# EAGLE design Gear Shifters (EAGLE 9.6.2)
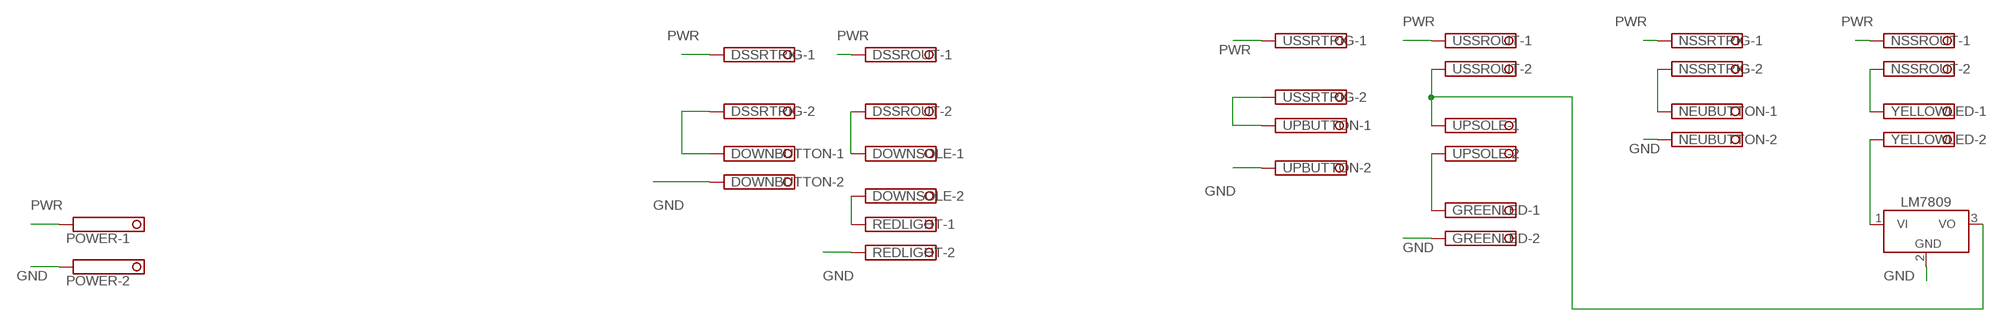
[diagram p0: schematic, sheet 1]

## Parts
DOWNBUTTON  TERMINAL-BLOCK-3.5MM-2-PIN-ROUND-PAD  [TERMINAL-BLOCK-2-PIN-3.5MM-ROUND-PAD]
DOWNSOLE  TERMINAL-BLOCK-3.5MM-2-PIN-ROUND-PAD  [TERMINAL-BLOCK-2-PIN-3.5MM-ROUND-PAD]
DSSROUT  TERMINAL-BLOCK-3.5MM-2-PIN-ROUND-PAD  [TERMINAL-BLOCK-2-PIN-3.5MM-ROUND-PAD]
DSSRTRIG  TERMINAL-BLOCK-3.5MM-2-PIN-ROUND-PAD  [TERMINAL-BLOCK-2-PIN-3.5MM-ROUND-PAD]
GREENLED  TERMINAL-BLOCK-3.5MM-2-PIN-ROUND-PAD  [TERMINAL-BLOCK-2-PIN-3.5MM-ROUND-PAD]
LM7809  LM7805_TO220V  [TO220V]
NEUBUTTON  TERMINAL-BLOCK-3.5MM-2-PIN-ROUND-PAD  [TERMINAL-BLOCK-2-PIN-3.5MM-ROUND-PAD]
NSSROUT  TERMINAL-BLOCK-3.5MM-2-PIN-ROUND-PAD  [TERMINAL-BLOCK-2-PIN-3.5MM-ROUND-PAD]
NSSRTRIG  TERMINAL-BLOCK-3.5MM-2-PIN-ROUND-PAD  [TERMINAL-BLOCK-2-PIN-3.5MM-ROUND-PAD]
POWER  TERMINAL-BLOCK-3.5MM-2-PIN-ROUND-PAD  [TERMINAL-BLOCK-2-PIN-3.5MM-ROUND-PAD]
REDLIGHT  TERMINAL-BLOCK-3.5MM-2-PIN-ROUND-PAD  [TERMINAL-BLOCK-2-PIN-3.5MM-ROUND-PAD]
UPBUTTON  TERMINAL-BLOCK-3.5MM-2-PIN-ROUND-PAD  [TERMINAL-BLOCK-2-PIN-3.5MM-ROUND-PAD]
UPSOLE  TERMINAL-BLOCK-3.5MM-2-PIN-ROUND-PAD  [TERMINAL-BLOCK-2-PIN-3.5MM-ROUND-PAD]
USSROUT  TERMINAL-BLOCK-3.5MM-2-PIN-ROUND-PAD  [TERMINAL-BLOCK-2-PIN-3.5MM-ROUND-PAD]
USSRTRIG  TERMINAL-BLOCK-3.5MM-2-PIN-ROUND-PAD  [TERMINAL-BLOCK-2-PIN-3.5MM-ROUND-PAD]
YELLOWLED  TERMINAL-BLOCK-3.5MM-2-PIN-ROUND-PAD  [TERMINAL-BLOCK-2-PIN-3.5MM-ROUND-PAD]

## Nets
GND: DOWNBUTTON.2 GREENLED.2 LM7809.2(GND) NEUBUTTON.2 POWER.2 REDLIGHT.2 UPBUTTON.2
N$1: DOWNBUTTON.1 DSSRTRIG.2
N$2: DOWNSOLE.1 DSSROUT.2
N$3: UPBUTTON.1 USSRTRIG.2
N$4: DOWNSOLE.2 REDLIGHT.1
N$5: NEUBUTTON.1 NSSRTRIG.2
N$6: NSSROUT.2 YELLOWLED.1
N$7: LM7809.1(VI) YELLOWLED.2
N$9: LM7809.3(VO) UPSOLE.1 USSROUT.2
N$10: GREENLED.1 UPSOLE.2
PWR: DSSROUT.1 DSSRTRIG.1 NSSROUT.1 NSSRTRIG.1 POWER.1 USSROUT.1 USSRTRIG.1

## Library data of the parts
DOWNBUTTON DOWNSOLE DSSROUT DSSRTRIG GREENLED NEUBUTTON NSSROUT NSSRTRIG POWER REDLIGHT UPBUTTON UPSOLE USSROUT USSRTRIG YELLOWLED = Rembrandt Electronics - Terminal Block 3-5mm v1-0:TERMINAL-BLOCK-3.5MM-2-PIN: Terminal Block 3.5mm Pitch: 3,5 mm Number of pins: 2 Created by Rembrandt Electronics www.rembrandtelectronics.com
LM7809 = IC_Power-Management:LM7805: 5V Voltage Regulator Reference Datasheet <https://www.ti.com/lit/ds/symlink/lm340.pdf>; CATEGORY: IC_Linear; DESCRIPTION: 5V Voltage Regulator; MANUFACTURER: Generic; MPN: Generic; SERIES: LM7805; SUB-CATEGORY: Voltage Regulator; TYPE: 5V

## Board
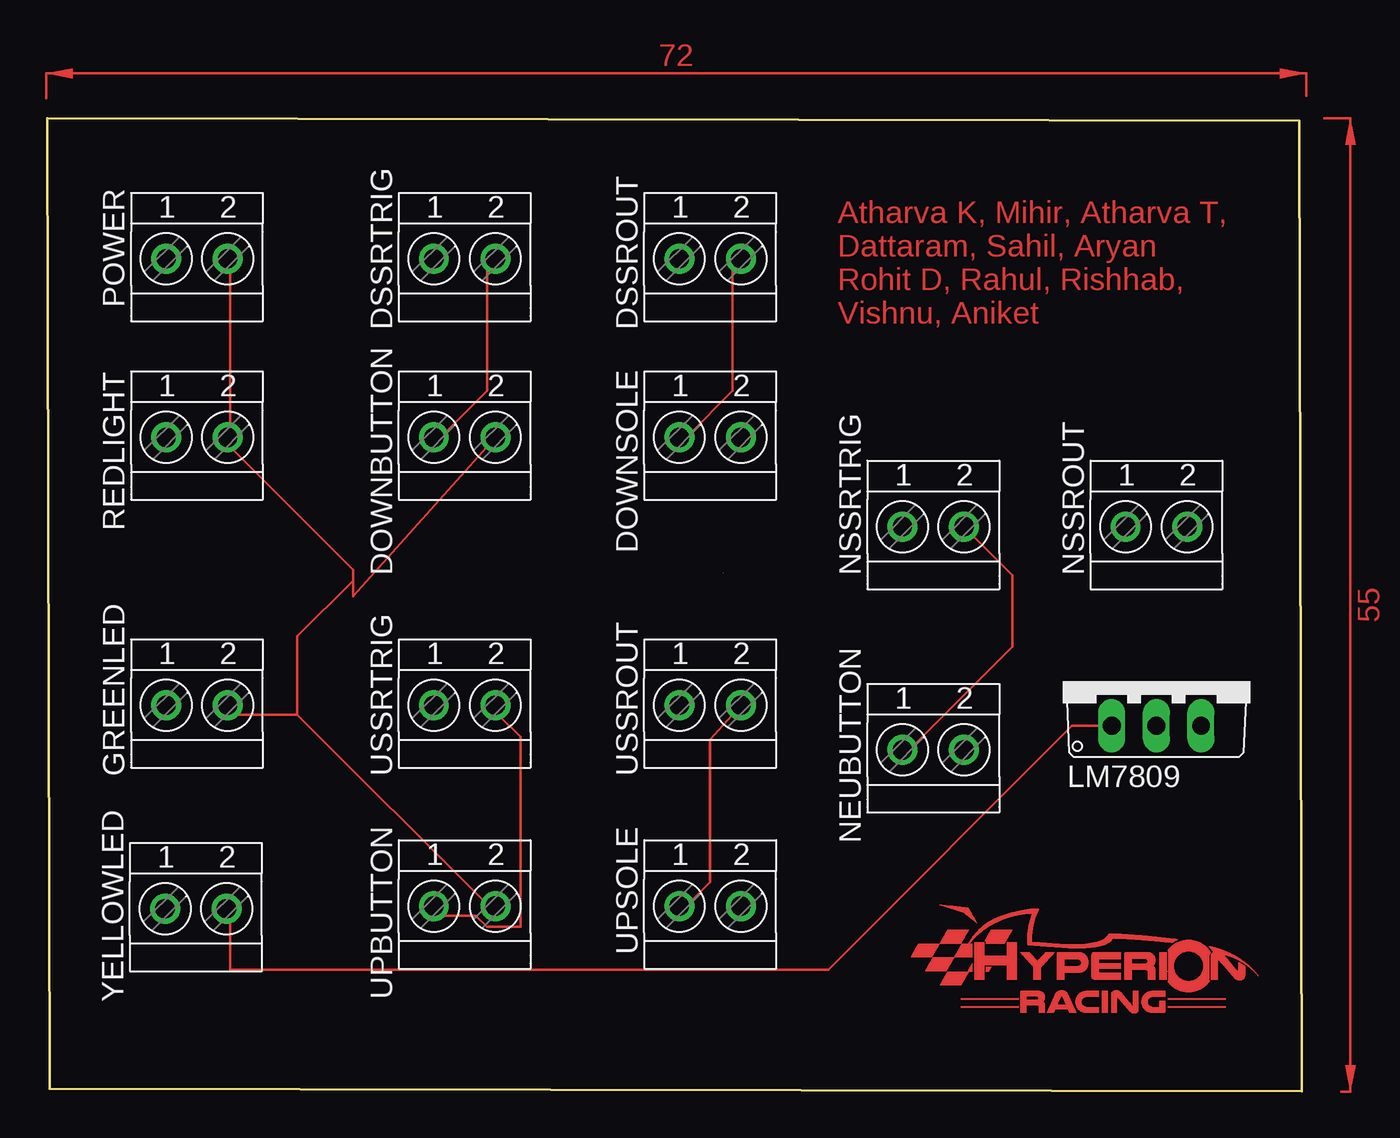
[diagram p1: board, top side]
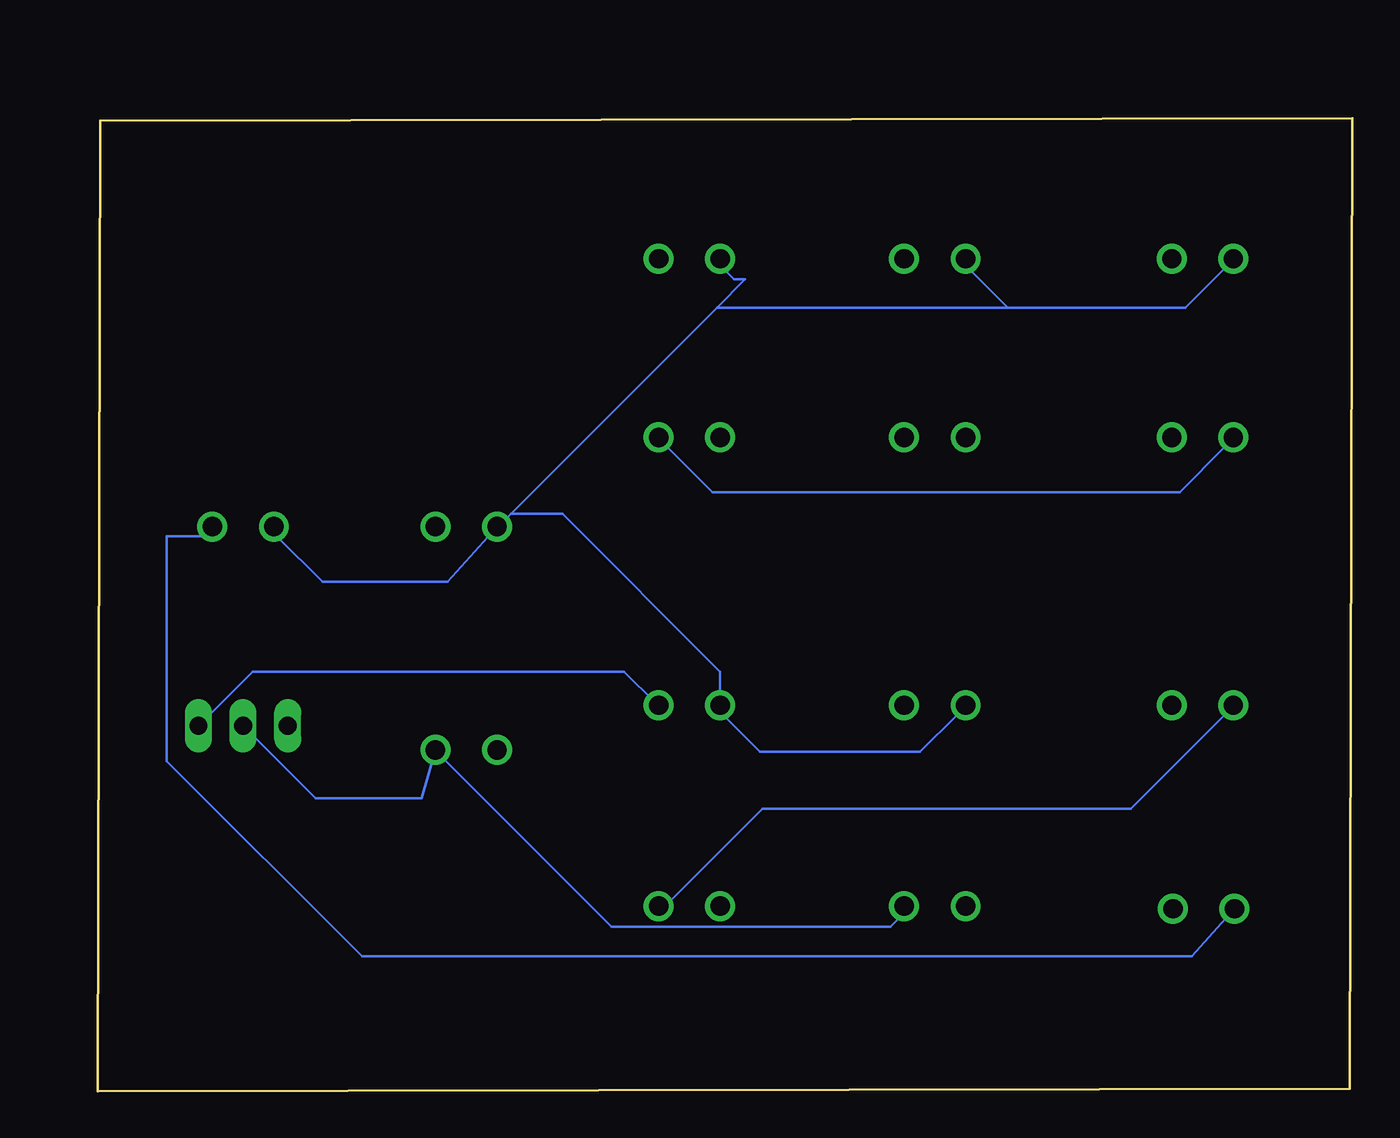
[diagram p2: board, bottom side, seen from below]

Size 71.41 x 55.37 mm. Coordinates in mm from the lower left corner, seen from the top.
Outline: 0,55.37 71.27,55.22 71.41,0 0.14,0.15 0,55.37
Copper layers (1*16): Top 0.035mm / dielectric 1.5mm / Bottom 0.035mm
Design rules "default": minimum track width 6mil, minimum drill 0.35mm, track to track 6mil, track to pad 6mil, pad to pad 6mil, via to via 6mil, smd to smd 6mil, copper to edge 40mil, drill to drill 6mil, minimum pad ring 10mil, minimum via ring 8mil, stop-mask expansion 4mil, vias tented up to drill 0mil, thermal gap 10mil

### Footprints (pad centres in the part's own frame; a part is rotated, then mirrored left to right if it is on the bottom)
TERMINAL-BLOCK-2-PIN-3.5MM-ROUND-PAD = drill 1.1 pad 1.7: 1 -1.75,-0.1; 2 1.75,-0.1
TO220V = drill 1.016 long: 1 -2.54,-2.54; 2 0,-2.54; 3 2.54,-2.54

### Placement (x,y rotation side)
DOWNBUTTON  23.76,37.31 0 top
DOWNSOLE  37.73,37.31 0 top
DSSROUT  37.73,47.47 0 top
DSSRTRIG  23.76,47.47 0 top
GREENLED  8.52,22.07 0 top
LM7809  63.13,23.34 0 top
NEUBUTTON  50.43,19.53 0 top
NSSROUT  63.13,32.23 0 top
NSSRTRIG  50.43,32.23 0 top
POWER  8.52,47.47 0 top
REDLIGHT  8.52,37.31 0 top
UPBUTTON  23.76,10.64 0 top
UPSOLE  37.73,10.64 0 top
USSROUT  37.73,22.07 0 top
USSRTRIG  23.76,22.07 0 top
YELLOWLED  8.46,10.49 0 top

### Tracks (layer width: path | path; a pad name or v marks a point on that pad's centre or on a via)
GND
  Top 0.152: POWER.2 10.42,46.84 10.42,37.31 REDLIGHT.2 10.42,36.68 17.41,29.69 17.41,29.06 | 14.23,21.44 25.03,10.64 UPBUTTON.2 | 14.23,21.44 10.42,21.44 GREENLED.2 | 17.41,29.06 14.23,25.88 14.23,21.44 | DOWNBUTTON.2 17.41,28.18 17.41,29.06
  Bottom 0.152: LM7809.2 59.01,16.68 52.97,16.68 NEUBUTTON.2 51.7,18.9 42.17,9.37 26.3,9.37 25.66,10.01 UPBUTTON.2
N$1
  Top 0.152: DOWNBUTTON.1 22.49,37.31 25.03,39.85 25.03,46.84 DSSRTRIG.2
N$2
  Top 0.152: DOWNSOLE.1 36.46,37.31 39,39.85 39,46.84 DSSROUT.2
N$3
  Top 0.152: UPBUTTON.1 22.49,10.01 24.39,10.01 25.03,9.37 26.93,9.37 26.93,20.17 25.66,21.44 USSRTRIG.2
N$4
  Bottom 0.152: REDLIGHT.1 7.25,36.68 9.83,34.1 36.42,34.1 39,36.68 DOWNSOLE.2
N$5
  Top 0.152: NSSRTRIG.2 54.93,29.38 54.93,25.3 49.16,19.53 NEUBUTTON.1
N$6
  Bottom 0.152: YELLOWLED.1 9.14,7.69 56.36,7.69 67.47,18.8 67.47,31.6 65.03,31.6 NSSROUT.2
N$7
  Top 0.152: LM7809.1 58.33,20.8 44.45,6.93 10.42,6.93 10.42,9.66 YELLOWLED.2
N$9
  Top 0.152: UPSOLE.1 36.46,10.64 37.72,11.91 37.72,20.02 USSROUT.2
  Bottom 0.152: LM7809.3 62.59,23.88 41.44,23.88 39.63,22.07 USSROUT.2
N$10
  Bottom 0.152: GREENLED.1 7.25,21.44 12.61,16.08 33.56,16.08 39,10.64 UPSOLE.2
PWR
  Bottom 0.152: USSRTRIG.1 22.49,21.44 24.6,19.33 33.71,19.33 35.82,21.44 USSROUT.1 35.98,23.89 44.96,32.87 47.89,32.87 | NSSROUT.1 61.22,31.6 58.61,28.99 51.5,28.99 NSSRTRIG.1 48.52,32.23 47.89,32.87 | 19.6,44.59 9.5,44.59 7.25,46.84 POWER.1 | 19.6,44.59 21.85,46.84 DSSRTRIG.1 | 19.6,44.59 36.17,44.59 | DSSROUT.1 35.82,46.84 35.19,46.2 34.55,46.2 36.17,44.59 | 36.17,44.59 47.89,32.87
(copper drawn outside any net)
  shapes: Route2 area x20, Route3 area x8663, Route4 area x7260, Route5 area x24, Route6 area x13567, Top area x10298

### Text on the board
Top: Atharva K, Mihir, Atharva T, / Dattaram, Sahil, Aryan / Rohit D, Rahul, Rishhab, / Vishnu, Aniket
Route6: C:/Users/TheStreak/Downloads/Black Trans.bmp | C:/Users/TheStreak/Downloads/Black Trans.bmp